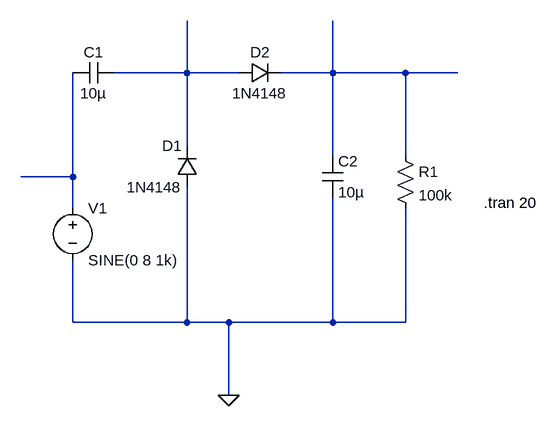
[diagram p0: schematic expt3_2.asc]
expt3_2.asc, the LTspice schematic file:
Version 4
SHEET 1 880 680
WIRE 208 -64 208 -144
WIRE 208 -64 96 -64
WIRE 288 -64 208 -64
WIRE 432 -64 432 -144
WIRE 432 -64 352 -64
WIRE 544 -64 432 -64
WIRE 624 -64 544 -64
WIRE 208 48 208 -64
WIRE 432 64 432 -64
WIRE 544 64 544 -64
WIRE 32 96 32 -64
WIRE 32 96 -48 96
WIRE 32 144 32 96
WIRE 32 320 32 224
WIRE 208 320 208 112
WIRE 208 320 32 320
WIRE 272 320 208 320
WIRE 432 320 432 128
WIRE 432 320 272 320
WIRE 544 320 544 144
WIRE 544 320 432 320
WIRE 272 432 272 320
FLAG 272 432 0
SYMBOL voltage 32 128 R0
WINDOW 123 0 0 Left 2
WINDOW 39 0 0 Left 2
SYMATTR InstName V1
SYMATTR Value SINE(0 8 1k)
SYMBOL cap 96 -80 R90
WINDOW 0 0 32 VBottom 2
WINDOW 3 32 32 VTop 2
SYMATTR InstName C1
SYMATTR Value 10µ
SYMBOL diode 224 112 R180
WINDOW 0 24 64 Left 2
WINDOW 3 24 0 Left 2
SYMATTR InstName D1
SYMATTR Value 1N4148
SYMBOL diode 288 -48 R270
WINDOW 0 32 32 VTop 2
WINDOW 3 0 32 VBottom 2
SYMATTR InstName D2
SYMATTR Value 1N4148
SYMBOL cap 416 64 R0
SYMATTR InstName C2
SYMATTR Value 10µ
SYMBOL res 528 48 R0
SYMATTR InstName R1
SYMATTR Value 100k
TEXT 664 136 Left 2 !.tran 20

The netlist it stands for:
* expt3_2.asc
V1 N003 0 SINE(0 8 1k)
C1 N001 N003 10µ
D1 0 N001 1N4148
D2 N001 N002 1N4148
C2 N002 0 10µ
R1 N002 0 100k
.model D D
.lib standard.dio
.tran 20
.backanno
.end